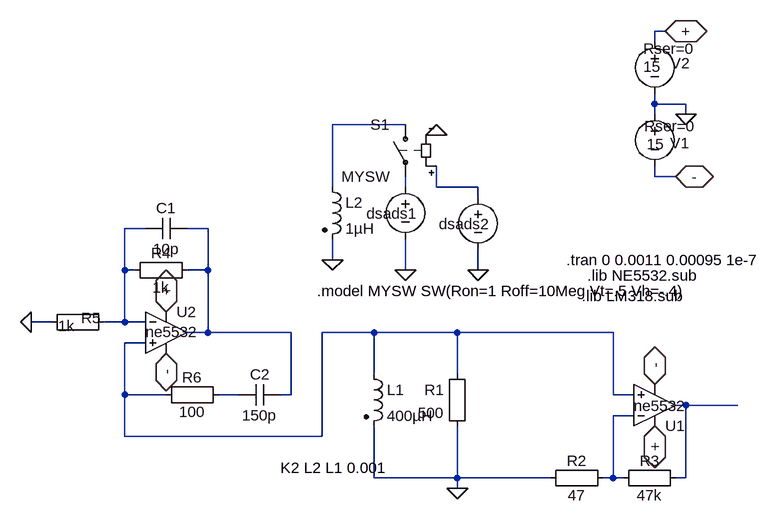
[diagram p0: schematic nehative_capcaitance_BS_6.asc]
nehative_capcaitance_BS_6.asc, the LTspice schematic file:
Version 4
SHEET 1 880 680
WIRE -1088 -256 -1104 -256
WIRE -1104 -240 -1104 -256
WIRE -1104 -144 -1104 -160
WIRE -1056 -144 -1104 -144
WIRE -1104 -128 -1104 -144
WIRE -1056 -128 -1056 -144
WIRE -1488 -112 -1600 -112
WIRE -1104 -32 -1104 -48
WIRE -1072 -32 -1104 -32
WIRE -1600 -16 -1600 -112
WIRE -1488 -16 -1488 -32
WIRE -1440 -16 -1440 -48
WIRE -1376 -16 -1440 -16
WIRE -1376 0 -1376 -16
WIRE -1888 48 -1920 48
WIRE -1792 48 -1824 48
WIRE -1600 96 -1600 64
WIRE -1920 112 -1920 48
WIRE -1904 112 -1920 112
WIRE -1792 112 -1792 48
WIRE -1792 112 -1824 112
WIRE -1488 112 -1488 64
WIRE -1376 112 -1376 80
WIRE -2032 192 -2064 192
WIRE -1920 192 -1920 112
WIRE -1920 192 -1952 192
WIRE -1888 192 -1920 192
WIRE -1792 208 -1792 112
WIRE -1792 208 -1824 208
WIRE -1664 208 -1792 208
WIRE -1536 208 -1616 208
WIRE -1408 208 -1536 208
WIRE -1168 208 -1408 208
WIRE -1888 224 -1920 224
WIRE -1536 272 -1536 208
WIRE -1408 272 -1408 208
WIRE -1920 304 -1920 224
WIRE -1856 304 -1920 304
WIRE -1744 304 -1776 304
WIRE -1664 304 -1664 208
WIRE -1664 304 -1680 304
WIRE -1168 304 -1168 208
WIRE -1136 304 -1168 304
WIRE -1056 320 -1072 320
WIRE -976 320 -1056 320
WIRE -1136 336 -1168 336
WIRE -1920 368 -1920 304
WIRE -1616 368 -1616 208
WIRE -1616 368 -1920 368
WIRE -1536 432 -1536 352
WIRE -1408 432 -1408 352
WIRE -1408 432 -1536 432
WIRE -1264 432 -1408 432
WIRE -1168 432 -1168 336
WIRE -1168 432 -1184 432
WIRE -1152 432 -1168 432
WIRE -1056 432 -1056 320
WIRE -1056 432 -1072 432
WIRE -1408 448 -1408 432
FLAG -1072 -32 -
IOPIN -1072 -32 BiDir
FLAG -1088 -256 +
IOPIN -1088 -256 BiDir
FLAG -1056 -128 0
FLAG -1104 352 +
IOPIN -1104 352 BiDir
FLAG -1104 288 -
IOPIN -1104 288 BiDir
FLAG -1856 176 +
IOPIN -1856 176 BiDir
FLAG -1856 240 -
IOPIN -1856 240 BiDir
FLAG -2064 192 0
FLAG -1408 448 0
FLAG -1488 112 0
FLAG -1376 112 0
FLAG -1600 96 0
FLAG -1440 -96 0
SYMBOL voltage -1104 -144 M0
WINDOW 123 0 0 Left 2
WINDOW 39 -63 34 Left 2
WINDOW 0 -53 60 Left 2
WINDOW 3 -15 62 Left 2
SYMATTR SpiceLine Rser=0
SYMATTR InstName V1
SYMATTR Value 15
SYMBOL voltage -1104 -256 M0
WINDOW 123 0 0 Left 2
WINDOW 39 -61 27 Left 2
WINDOW 0 -54 49 Left 2
WINDOW 3 -9 55 Left 2
SYMATTR SpiceLine Rser=0
SYMATTR InstName V2
SYMATTR Value 15
SYMBOL Misc\\EuropeanResistor -1392 256 M0
SYMATTR InstName R1
SYMATTR Value 500
SYMBOL Opamps\\opamp2 -1104 384 M180
WINDOW 3 -32 63 Left 2
SYMATTR Value ne5532
SYMATTR InstName U1
SYMBOL Misc\\EuropeanResistor -1280 448 R270
WINDOW 0 27 56 VTop 2
WINDOW 3 5 56 VBottom 2
SYMATTR InstName R2
SYMATTR Value 47
SYMBOL Misc\\EuropeanResistor -1168 448 R270
WINDOW 0 27 56 VTop 2
WINDOW 3 5 56 VBottom 2
SYMATTR InstName R3
SYMATTR Value 47k
SYMBOL ind2 -1552 256 R0
SYMATTR InstName L1
SYMATTR Value 400µH
SYMATTR SpiceLine Rser=.4 Cpar=220p
SYMATTR Type ind
SYMBOL Opamps\\opamp2 -1856 144 R0
WINDOW 3 -32 63 Left 2
SYMATTR Value ne5532
SYMATTR InstName U2
SYMBOL Misc\\EuropeanResistor -1920 96 M90
WINDOW 0 5 56 VBottom 2
WINDOW 3 27 56 VTop 2
SYMATTR InstName R4
SYMATTR Value 1k
SYMBOL Misc\\EuropeanCap -1824 64 M270
WINDOW 0 32 32 VTop 2
WINDOW 3 0 32 VBottom 2
SYMATTR InstName C1
SYMATTR Value 10p
SYMATTR SpiceLine V=400 Irms=1 Rser=.32 Lser=0
SYMBOL Misc\\EuropeanResistor -2048 176 M90
WINDOW 0 25 76 VBottom 2
WINDOW 3 6 38 VTop 2
SYMATTR InstName R5
SYMATTR Value 1k
SYMBOL Misc\\EuropeanCap -1680 320 M270
WINDOW 0 32 32 VTop 2
WINDOW 3 0 32 VBottom 2
SYMATTR InstName C2
SYMATTR Value 150p
SYMATTR SpiceLine V=400 Irms=1 Rser=.32 Lser=0
SYMBOL Misc\\EuropeanResistor -1872 288 M90
WINDOW 0 5 56 VBottom 2
WINDOW 3 27 56 VTop 2
SYMATTR InstName R6
SYMATTR Value 100
SYMBOL ind2 -1616 -32 R0
SYMATTR InstName L2
SYMATTR Value 1µH
SYMATTR SpiceLine Rser=.1 Rpar=1 Cpar=1p
SYMATTR Type ind
SYMBOL voltage -1488 -32 M0
WINDOW 0 -18 57 Left 2
WINDOW 3 -134 119 Invisible 2
WINDOW 123 0 0 Left 2
SYMATTR InstName dsads1
SYMATTR Value .01
SYMATTR SpiceLine Rser=0
SYMBOL sw -1488 -128 M0
SYMATTR InstName S1
SYMATTR Value MYSW
SYMBOL voltage -1376 -16 M0
WINDOW 0 -18 57 Left 2
WINDOW 3 -134 119 Invisible 2
WINDOW 123 0 0 Left 2
SYMATTR InstName dsads2
SYMATTR Value PULSE(0 10 0 1e-10 1e-10 .000001 .001 1000)
TEXT -1240 96 Left 2 !.tran 0 0.0011 0.00095 1e-7
TEXT -1208 120 Left 2 !.lib NE5532.sub
TEXT -1216 152 Left 2 !.lib LM318.sub
TEXT -1624 144 Left 2 !.model MYSW SW(Ron=1 Roff=10Meg Vt=.5 Vh=-.4)
TEXT -1680 416 Left 2 !K2 L2 L1 0.001

The netlist it stands for:
* nehative_capcaitance_BS_6.asc
V1 0 - 15 Rser=0
V2 + 0 15 Rser=0
R1 N006 0 500
XU1 N006 N009 + - N008 ne5532  ; pins In+ In- V+ V- OUT
R2 0 N009 47
R3 N009 N008 47k
L1 N006 0 400µH Rser=.4 Cpar=220p
XU2 N006 N004 + - N005 ne5532  ; pins In+ In- V+ V- OUT
R4 N004 N005 1k
C1 N005 N004 10p V=400 Irms=1 Rser=.32 Lser=0
R5 0 N004 1k
C2 N005 N007 150p V=400 Irms=1 Rser=.32 Lser=0
R6 N006 N007 100
L2 N001 0 1µH Rser=.1 Rpar=1 Cpar=1p
V§dsads1 N002 0 .01 Rser=0
S1 N001 N002 N003 0 MYSW
V§dsads2 N003 0 PULSE(0 10 0 1e-10 1e-10 .000001 .001 1000)
.tran 0 0.0011 0.00095 1e-7
.lib NE5532.sub
.lib LM318.sub
.model MYSW SW(Ron=1 Roff=10Meg Vt=.5 Vh=-.4)
K2 L2 L1 0.001
.backanno
.end